# Altium schematic sheet MCU_hall_crossboard_1_1.SchDoc
size A3
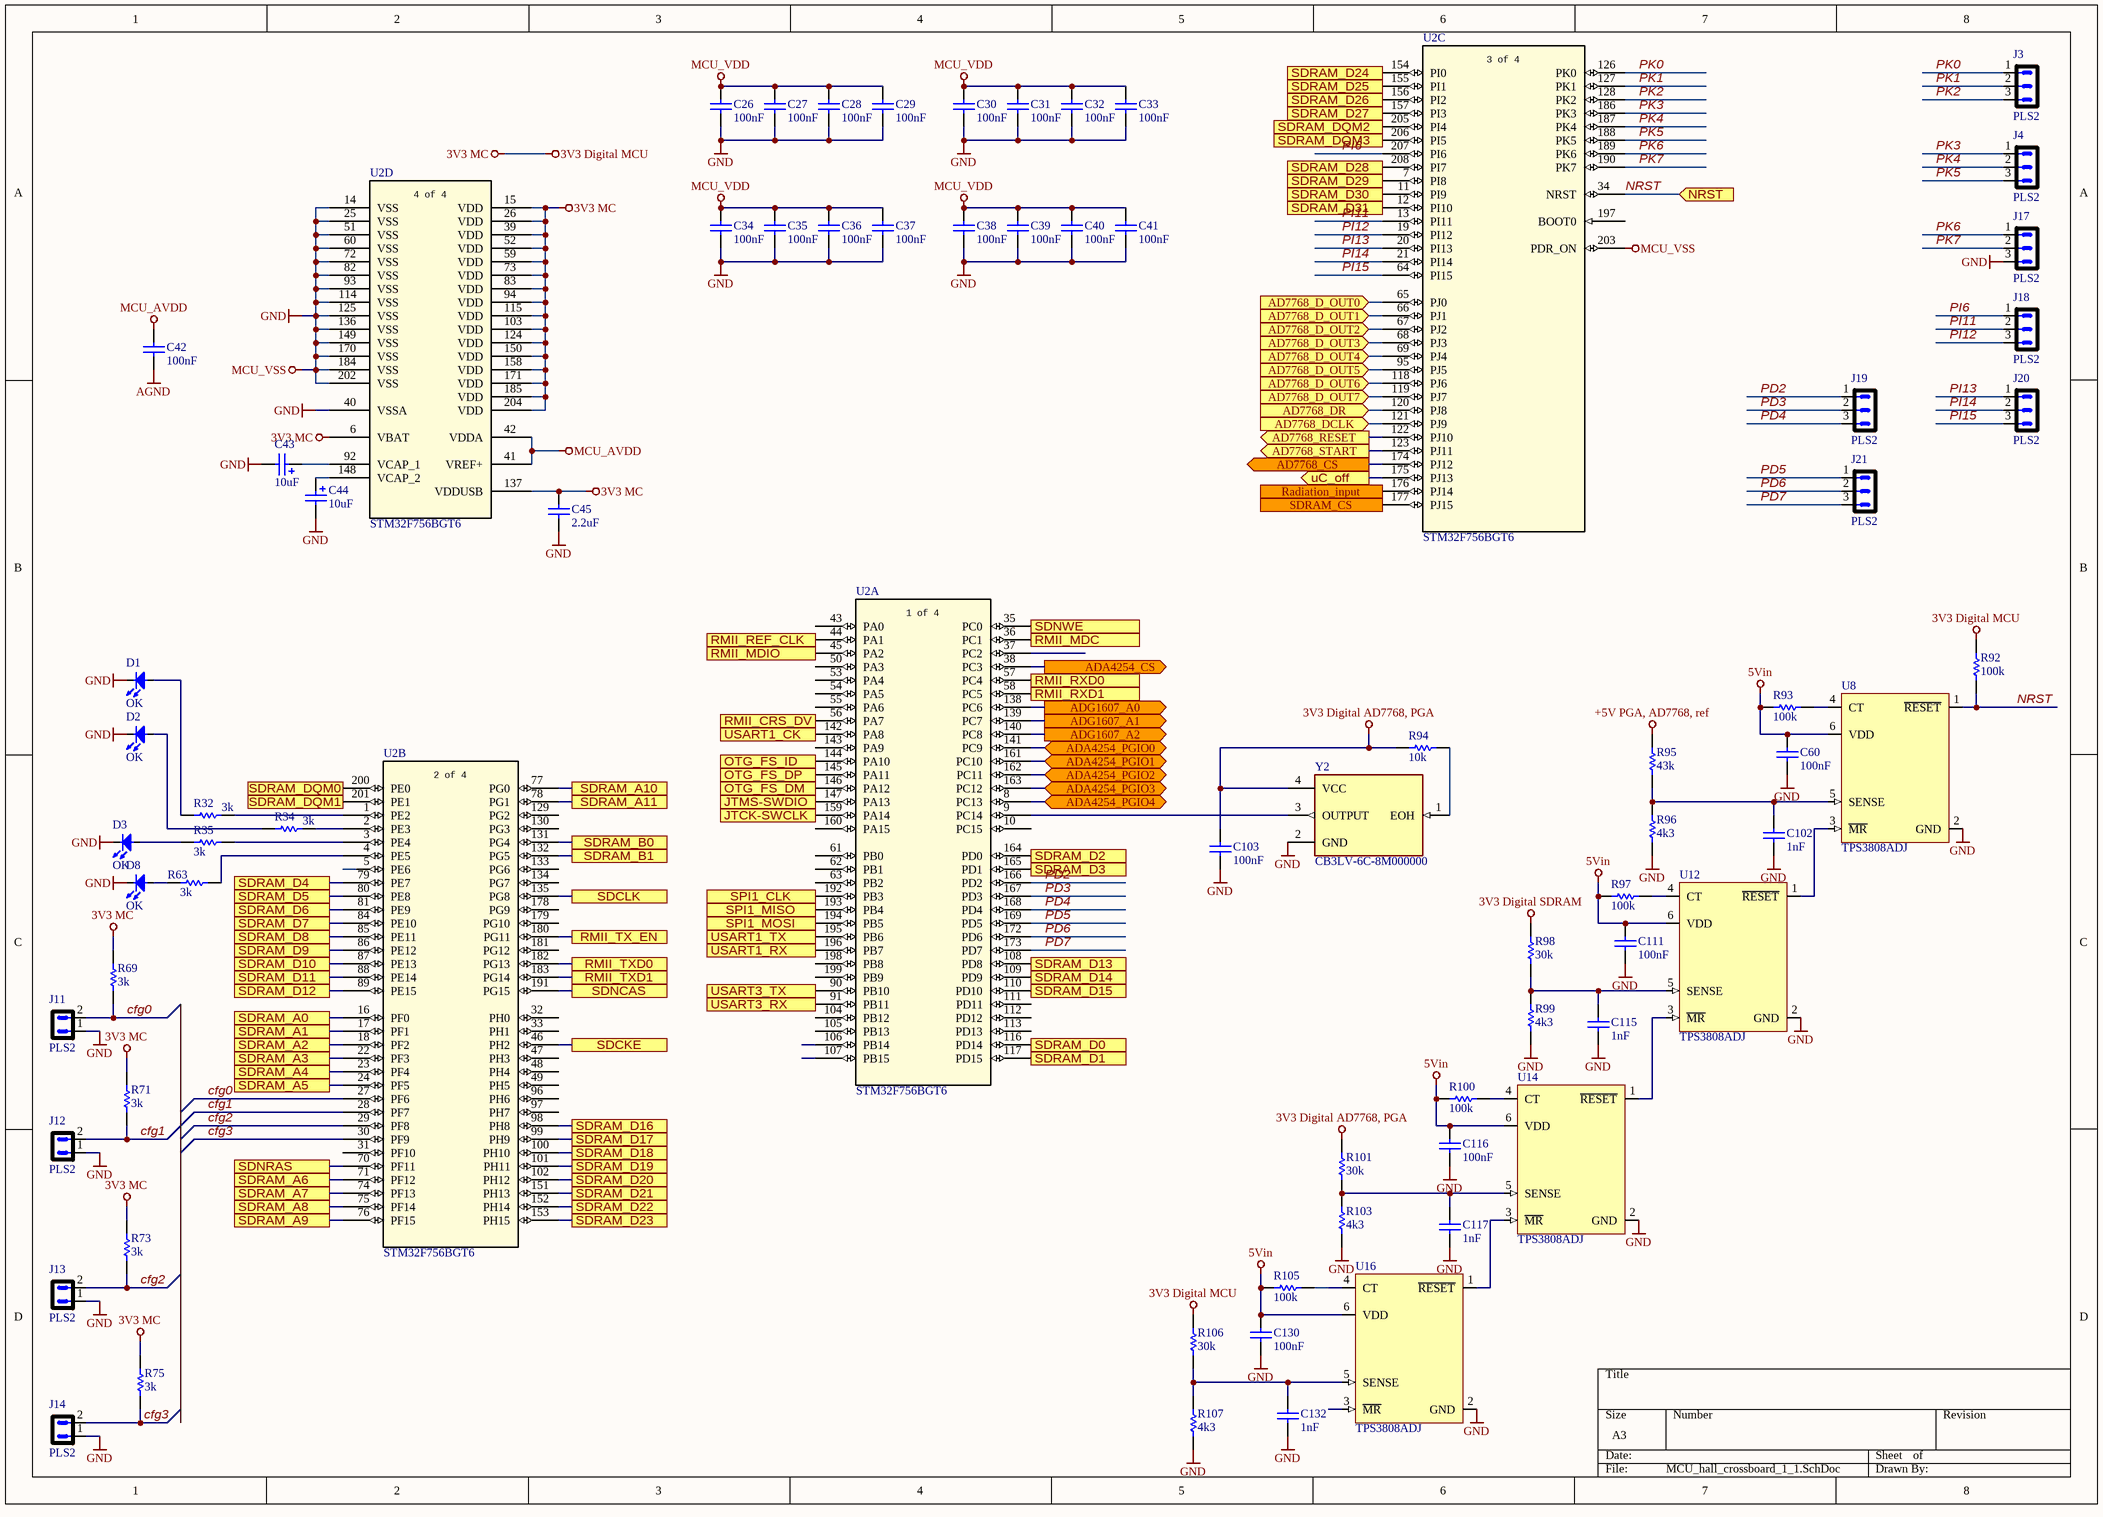
[diagram p0: MCU_hall_crossboard_1_1.SchDoc]

## Parts
C26  100nF  [0603C]
C27  100nF  [0603C]
C28  100nF  [0603C]
C29  100nF  [0603C]
C30  100nF  [0603C]
C31  100nF  [0603C]
C32  100nF  [0603C]
C33  100nF  [0603C]
C34  100nF  [0603C]
C35  100nF  [0603C]
C36  100nF  [0603C]
C37  100nF  [0603C]
C38  100nF  [0603C]
C39  100nF  [0603C]
C40  100nF  [0603C]
C41  100nF  [0603C]
C42  100nF  [0603C]
C43  10uF  [0805C]
C44  10uF  [0805C]
C45  2.2uF  [0805C]
C60  100nF  [0603C]
C102  1nF  [0603C]
C103  100nF  [0603C]
C111  100nF  [0603C]
C115  1nF  [0603C]
C116  100nF  [0603C]
C117  1nF  [0603C]
C130  100nF  [0603C]
C132  1nF  [0603C]
D1  OK  [LED0603]
D2  OK  [LED0603]
D3  OK  [LED0603]
D8  OK  [LED0603]
J3  PLS2  [COMATEL_385.0358.1.03.400]
J4  PLS2  [COMATEL_385.0358.1.03.400]
J11  PLS2  [SAMTEC_TSW-102-23-L-S]
J12  PLS2  [SAMTEC_TSW-102-23-L-S]
J13  PLS2  [SAMTEC_TSW-102-23-L-S]
J14  PLS2  [SAMTEC_TSW-102-23-L-S]
J17  PLS2  [COMATEL_385.0358.1.03.400]
J18  PLS2  [COMATEL_385.0358.1.03.400]
J19  PLS2  [COMATEL_385.0358.1.03.400]
J20  PLS2  [COMATEL_385.0358.1.03.400]
J21  PLS2  [COMATEL_385.0358.1.03.400]
R32  3k  [0603R]
R34  3k  [0603R]
R35  3k  [0603R]
R63  3k  [0603R]
R69  3k  [0603R]
R71  3k  [0603R]
R73  3k  [0603R]
R75  3k  [0603R]
R92  100k  [0805R]
R93  100k  [0805R]
R94  10k  [0805R]
R95  43k  [0805R]
R96  4k3  [0805R]
R97  100k  [0805R]
R98  30k  [0805R]
R99  4k3  [0805R]
R100  100k  [0805R]
R101  30k  [0805R]
R103  4k3  [0805R]
R105  100k  [0805R]
R106  30k  [0805R]
R107  4k3  [0805R]
U2  STM32F756BGT6  [QFP50P3000X3000X160-208N]  (parts A,B,C,D of 4)
U8  TPS3808ADJ  [SOT95P270X145-6N]
U12  TPS3808ADJ  [SOT95P270X145-6N]
U14  TPS3808ADJ  [SOT95P270X145-6N]
U16  TPS3808ADJ  [SOT95P270X145-6N]
Y2  CB3LV-6C-8M000000  [OSC_CB3LV-6C-8M000000]

## Ports
AD7768_CS (out), AD7768_D_OUT0 (in), AD7768_D_OUT1 (in), AD7768_D_OUT2 (in), AD7768_D_OUT3 (in), AD7768_D_OUT4 (in), AD7768_D_OUT5 (in), AD7768_D_OUT6 (in), AD7768_D_OUT7 (in), AD7768_DCLK (in), AD7768_DR (in), AD7768_RESET (out), AD7768_START (out), ADA4254_CS (out), ADA4254_PGIO0 (bidir), ADA4254_PGIO1 (bidir), ADA4254_PGIO2 (bidir), ADA4254_PGIO3 (bidir), ADA4254_PGIO4 (bidir), ADG1607_A0 (out), ADG1607_A1 (out), ADG1607_A2 (out), JTCK-SWCLK, JTMS-SWDIO, NRST (in), OTG_FS_DM, OTG_FS_DP, OTG_FS_ID, Radiation_input (in), RMII_CRS_DV, RMII_MDC, RMII_MDIO, RMII_REF_CLK, RMII_RXD0, RMII_RXD1, RMII_TX_EN, RMII_TXD0, RMII_TXD1, SDCKE, SDCLK, SDNCAS, SDNRAS, SDNWE, SDRAM_A0, SDRAM_A1, SDRAM_A2, SDRAM_A3, SDRAM_A4, SDRAM_A5, SDRAM_A6, SDRAM_A7, SDRAM_A8, SDRAM_A9, SDRAM_A10, SDRAM_A11, SDRAM_B0, SDRAM_B1, SDRAM_CS (out), SDRAM_D0, SDRAM_D1, SDRAM_D2, SDRAM_D3, SDRAM_D4, SDRAM_D5, SDRAM_D6, SDRAM_D7, SDRAM_D8, SDRAM_D9, SDRAM_D10, SDRAM_D11, SDRAM_D12, SDRAM_D13, SDRAM_D14, SDRAM_D15, SDRAM_D16, SDRAM_D17, SDRAM_D18, SDRAM_D19, SDRAM_D20, SDRAM_D21, SDRAM_D22, SDRAM_D23, SDRAM_D24, SDRAM_D25, SDRAM_D26, SDRAM_D27, SDRAM_D28, SDRAM_D29, SDRAM_D30, SDRAM_D31, SDRAM_DQM0, SDRAM_DQM1, SDRAM_DQM2, SDRAM_DQM3, SPI1_CLK, SPI1_MISO, SPI1_MOSI, uC_off (out), USART1_CK, USART1_RX, USART1_TX, USART3_RX, USART3_TX

## Nets
3V3 Digital AD7768, PGA: C103.1 R94.1 R101.2 Y2.4(VCC)
3V3 Digital MCU: C45.2 R69.2 R71.2 R73.2 R75.2 R92.2 R106.2 U2.6(VBAT) U2.15(VDD) U2.26(VDD) U2.39(VDD) U2.52(VDD) U2.59(VDD) U2.73(VDD) U2.83(VDD) U2.94(VDD) U2.103(VDD) U2.115(VDD) U2.124(VDD) U2.137(VDDUSB) U2.150(VDD) U2.158(VDD) U2.171(VDD) U2.185(VDD) U2.204(VDD)  [also labelled 3V3 MC]
3V3 Digital SDRAM: R98.2
5Vin: C60.2 C111.2 C116.2 C130.2 R93.1 R97.1 R100.1 R105.1 U8.6(VDD) U12.6(VDD) U14.6(VDD) U16.6(VDD)
+5V PGA, AD7768, ref: R95.2
AGND: C42.1
GND: C26.1 C27.1 C28.1 C29.1 C30.1 C31.1 C32.1 C33.1 C34.1 C35.1 C36.1 C37.1 C38.1 C39.1 C40.1 C41.1 C43.2 C44.2 C45.1 C60.1 C102.1 C103.2 C111.1 C115.1 C116.1 C117.1 C130.1 C132.1 D1.1(C) D2.1(C) D3.1(C) D8.1(C) J11.1 J12.1 J13.1 J14.1 J17.3 R96.1 R99.1 R103.1 R107.1 U2.14(VSS) U2.25(VSS) U2.40(VSSA) U2.51(VSS) U2.60(VSS) U2.72(VSS) U2.82(VSS) U2.93(VSS) U2.114(VSS) U2.125(VSS) U2.136(VSS) U2.149(VSS) U2.170(VSS) U2.184(VSS) U2.202(VSS) U2.203(PDR_ON) U8.2(GND) U12.2(GND) U14.2(GND) U16.2(GND) Y2.2(GND)  [also labelled MCU_VSS]
MCU_AVDD: C42.2 U2.41(VREF+) U2.42(VDDA)
MCU_VDD: C26.2 C27.2 C28.2 C29.2 C30.2 C31.2 C32.2 C33.2 C34.2 C35.2 C36.2 C37.2 C38.2 C39.2 C40.2 C41.2
AD7768_CS: U2.174(PJ12) ; port AD7768_CS
AD7768_D_OUT0: U2.65(PJ0) ; port AD7768_D_OUT0
AD7768_D_OUT1: U2.66(PJ1) ; port AD7768_D_OUT1
AD7768_D_OUT2: U2.67(PJ2) ; port AD7768_D_OUT2
AD7768_D_OUT3: U2.68(PJ3) ; port AD7768_D_OUT3
AD7768_D_OUT4: U2.69(PJ4) ; port AD7768_D_OUT4
AD7768_D_OUT5: U2.95(PJ5) ; port AD7768_D_OUT5
AD7768_D_OUT6: U2.118(PJ6) ; port AD7768_D_OUT6
AD7768_D_OUT7: U2.119(PJ7) ; port AD7768_D_OUT7
AD7768_DCLK: U2.121(PJ9) ; port AD7768_DCLK
AD7768_DR: U2.120(PJ8) ; port AD7768_DR
AD7768_RESET: U2.122(PJ10) ; port AD7768_RESET
AD7768_START: U2.123(PJ11) ; port AD7768_START
ADA4254_CS: U2.38(PC3) ; port ADA4254_CS
ADA4254_PGIO0: U2.141(PC9) ; port ADA4254_PGIO0
ADA4254_PGIO1: U2.161(PC10) ; port ADA4254_PGIO1
ADA4254_PGIO2: U2.162(PC11) ; port ADA4254_PGIO2
ADA4254_PGIO3: U2.163(PC12) ; port ADA4254_PGIO3
ADA4254_PGIO4: U2.8(PC13) ; port ADA4254_PGIO4
ADG1607_A0: U2.138(PC6) ; port ADG1607_A0
ADG1607_A1: U2.139(PC7) ; port ADG1607_A1
ADG1607_A2: U2.140(PC8) ; port ADG1607_A2
cfg0: J11.2 R69.1 U2.27(PF6)
cfg1: J12.2 R71.1 U2.28(PF7)
cfg2: J13.2 R73.1 U2.29(PF8)
cfg3: J14.2 R75.1 U2.30(PF9)
JTCK-SWCLK: U2.159(PA14) ; port JTCK-SWCLK
JTMS-SWDIO: U2.147(PA13) ; port JTMS-SWDIO
NRST: R92.1 U2.34(NRST) U8.1(~{RESET}) ; port NRST
OTG_FS_DM: U2.146(PA12) ; port OTG_FS_DM
OTG_FS_DP: U2.145(PA11) ; port OTG_FS_DP
OTG_FS_ID: U2.144(PA10) ; port OTG_FS_ID
PD2: J19.1 U2.166(PD2)
PD3: J19.2 U2.167(PD3)
PD4: J19.3 U2.168(PD4)
PD5: J21.1 U2.169(PD5)
PD6: J21.2 U2.172(PD6)
PD7: J21.3 U2.173(PD7)
PI6: J18.1 U2.207(PI6)
PI11: J18.2 U2.13(PI11)
PI12: J18.3 U2.19(PI12)
PI13: J20.1 U2.20(PI13)
PI14: J20.2 U2.21(PI14)
PI15: J20.3 U2.64(PI15)
PK0: J3.1 U2.126(PK0)
PK1: J3.2 U2.127(PK1)
PK2: J3.3 U2.128(PK2)
PK3: J4.1 U2.186(PK3)
PK4: J4.2 U2.187(PK4)
PK5: J4.3 U2.188(PK5)
PK6: J17.1 U2.189(PK6)
PK7: J17.2 U2.190(PK7)
Radiation_input: U2.176(PJ14) ; port Radiation_input
RMII_CRS_DV: U2.56(PA7) ; port RMII_CRS_DV
RMII_MDC: U2.36(PC1) ; port RMII_MDC
RMII_MDIO: U2.45(PA2) ; port RMII_MDIO
RMII_REF_CLK: U2.44(PA1) ; port RMII_REF_CLK
RMII_RXD0: U2.57(PC4) ; port RMII_RXD0
RMII_RXD1: U2.58(PC5) ; port RMII_RXD1
RMII_TX_EN: U2.180(PG11) ; port RMII_TX_EN
RMII_TXD0: U2.182(PG13) ; port RMII_TXD0
RMII_TXD1: U2.183(PG14) ; port RMII_TXD1
SDCKE: U2.46(PH2) ; port SDCKE
SDCLK: U2.135(PG8) ; port SDCLK
SDNCAS: U2.191(PG15) ; port SDNCAS
SDNRAS: U2.70(PF11) ; port SDNRAS
SDNWE: U2.35(PC0) ; port SDNWE
SDRAM_A0: U2.16(PF0) ; port SDRAM_A0
SDRAM_A1: U2.17(PF1) ; port SDRAM_A1
SDRAM_A2: U2.18(PF2) ; port SDRAM_A2
SDRAM_A3: U2.22(PF3) ; port SDRAM_A3
SDRAM_A4: U2.23(PF4) ; port SDRAM_A4
SDRAM_A5: U2.24(PF5) ; port SDRAM_A5
SDRAM_A6: U2.71(PF12) ; port SDRAM_A6
SDRAM_A7: U2.74(PF13) ; port SDRAM_A7
SDRAM_A8: U2.75(PF14) ; port SDRAM_A8
SDRAM_A9: U2.76(PF15) ; port SDRAM_A9
SDRAM_A10: U2.77(PG0) ; port SDRAM_A10
SDRAM_A11: U2.78(PG1) ; port SDRAM_A11
SDRAM_B0: U2.131(PG4) ; port SDRAM_B0
SDRAM_B1: U2.132(PG5) ; port SDRAM_B1
SDRAM_CS: U2.177(PJ15) ; port SDRAM_CS
SDRAM_D0: U2.116(PD14) ; port SDRAM_D0
SDRAM_D1: U2.117(PD15) ; port SDRAM_D1
SDRAM_D2: U2.164(PD0) ; port SDRAM_D2
SDRAM_D3: U2.165(PD1) ; port SDRAM_D3
SDRAM_D4: U2.79(PE7) ; port SDRAM_D4
SDRAM_D5: U2.80(PE8) ; port SDRAM_D5
SDRAM_D6: U2.81(PE9) ; port SDRAM_D6
SDRAM_D7: U2.84(PE10) ; port SDRAM_D7
SDRAM_D8: U2.85(PE11) ; port SDRAM_D8
SDRAM_D9: U2.86(PE12) ; port SDRAM_D9
SDRAM_D10: U2.87(PE13) ; port SDRAM_D10
SDRAM_D11: U2.88(PE14) ; port SDRAM_D11
SDRAM_D12: U2.89(PE15) ; port SDRAM_D12
SDRAM_D13: U2.108(PD8) ; port SDRAM_D13
SDRAM_D14: U2.109(PD9) ; port SDRAM_D14
SDRAM_D15: U2.110(PD10) ; port SDRAM_D15
SDRAM_D16: U2.98(PH8) ; port SDRAM_D16
SDRAM_D17: U2.99(PH9) ; port SDRAM_D17
SDRAM_D18: U2.100(PH10) ; port SDRAM_D18
SDRAM_D19: U2.101(PH11) ; port SDRAM_D19
SDRAM_D20: U2.102(PH12) ; port SDRAM_D20
SDRAM_D21: U2.151(PH13) ; port SDRAM_D21
SDRAM_D22: U2.152(PH14) ; port SDRAM_D22
SDRAM_D23: U2.153(PH15) ; port SDRAM_D23
SDRAM_D24: U2.154(PI0) ; port SDRAM_D24
SDRAM_D25: U2.155(PI1) ; port SDRAM_D25
SDRAM_D26: U2.156(PI2) ; port SDRAM_D26
SDRAM_D27: U2.157(PI3) ; port SDRAM_D27
SDRAM_D28: U2.208(PI7) ; port SDRAM_D28
SDRAM_D29: U2.7(PI8) ; port SDRAM_D29
SDRAM_D30: U2.11(PI9) ; port SDRAM_D30
SDRAM_D31: U2.12(PI10) ; port SDRAM_D31
SDRAM_DQM0: U2.200(PE0) ; port SDRAM_DQM0
SDRAM_DQM1: U2.201(PE1) ; port SDRAM_DQM1
SDRAM_DQM2: U2.205(PI4) ; port SDRAM_DQM2
SDRAM_DQM3: U2.206(PI5) ; port SDRAM_DQM3
SPI1_CLK: U2.192(PB3) ; port SPI1_CLK
SPI1_MISO: U2.193(PB4) ; port SPI1_MISO
SPI1_MOSI: U2.194(PB5) ; port SPI1_MOSI
uC_off: U2.175(PJ13) ; port uC_off
USART1_CK: U2.142(PA8) ; port USART1_CK
USART1_RX: U2.196(PB7) ; port USART1_RX
USART1_TX: U2.195(PB6) ; port USART1_TX
USART3_RX: U2.91(PB11) ; port USART3_RX
USART3_TX: U2.90(PB10) ; port USART3_TX
NetC43_1: C43.1 U2.92(VCAP_1)
NetC44_1: C44.1 U2.148(VCAP_2)
NetC102_2: C102.2 R95.1 R96.2 U8.5(SENSE)
NetC115_2: C115.2 R98.1 R99.2 U12.5(SENSE)
NetC117_2: C117.2 R101.1 R103.2 U14.5(SENSE)
NetC132_2: C132.2 R106.1 R107.2 U16.5(SENSE)
NetD1_2: D1.2(A) R32.1
NetD2_2: D2.2(A) R34.1
NetD3_2: D3.2(A) R35.1
NetD8_2: D8.2(A) R63.1
NetR32_2: R32.2 U2.1(PE2)
NetR34_2: R34.2 U2.2(PE3)
NetR35_2: R35.2 U2.3(PE4)
NetR63_2: R63.2 U2.4(PE5)
NetR93_2: R93.2 U8.4(CT)
NetR94_2: R94.2 Y2.1(EOH)
NetR97_2: R97.2 U12.4(CT)
NetR100_2: R100.2 U14.4(CT)
NetR105_2: R105.2 U16.4(CT)
NetU2_9: U2.9(PC14) Y2.3(OUTPUT)
NetU8_3: U8.3(~{MR}) U12.1(~{RESET})
NetU12_3: U12.3(~{MR}) U14.1(~{RESET})
NetU14_3: U14.3(~{MR}) U16.1(~{RESET})

Not connected (* = marked no-connect by the designer): U2 5(PE6) 10(PC15) 31(PF10) 32(PH0) 33(PH1) 37(PC2) 43(PA0) 47(PH3) 48(PH4) 49(PH5) 50(PA3) 53(PA4) 54(PA5) 55(PA6) 61(PB0) 62(PB1) 63(PB2) 96(PH6) 97(PH7) 104(PB12) 105(PB13) 106(PB14) 107(PB15) 111(PD11) 112(PD12) 113(PD13) 129(PG2) 130(PG3) 133(PG6) 134(PG7) 143(PA9) 160(PA15) 178(PG9) 179(PG10) 181(PG12) 197(BOOT0) 198(PB8) 199(PB9); U16 3(~{MR})

## Notes on the sheet
- (in symbol STM32F756BGT6, part A) 1 of 4
- (in symbol STM32F756BGT6, part B) 2 of 4
- (in symbol STM32F756BGT6, part C) 3 of 4
- (in symbol STM32F756BGT6, part D) 4 of 4

## Library data of the parts
C26-C42 C45 C60 C103 C111 C116 C130 = Capacitor_ST: Capacitor 0402 / 0603 / 0805; Revision: July-2002: Re-released for DXP Platform.
  C26-C42 C60 C103 C111 C116 C130: Value: 100nF
  C45: Value: 2.2uF
C43 C44 = Cap_10uF_POL_10%_TANA: Polarized Capacitor,10uF,10V,10%,typeA,VISHAY; Manuf_Part_1: 293D106X9010A2TE3; Revision: July-2002: Re-released for DXP Platform.; Value: 10uF; Manuf_1: VISHAY; Order: *; ECCN_US/EU: n/a
C102 C115 C117 C132 = Capacitor_ST: Capacitor 0402 / 0603 / 0805; Value: 100nF; Revision: July-2002: Re-released for DXP Platform.
D1-D3 D8 = LED0603: Чип светодиод 0603; Vendor: KB; SMD Solders: 2; Solder Option: RM; Pkg: SMD0603; Price: 10; Value: OK; Device: LED0603
J3 J4 J17-J21 = PLS3: Vendor: Confly; SMD Solders: 0; Solder Option: RM; THD Solders: 2; Price: 1; Device: PLS2
J11-J14 = PLS2: Vendor: Confly; SMD Solders: 0; Solder Option: RM; THD Solders: 2; Price: 1; Device: PLS2
R32 R34 R35 R63 R69 R71 R73 R75 R92 R93 R96-R101 R103 R105-R107 = Resistor_ST: Resistor 0402 / 0603 / 0805
  R32 R34 R35 R63 R69 R71 R73 R75: Value: 3k
  R92 R93 R97 R100 R105: Value: 100k
  R96 R99 R103 R107: Value: 4k3
  R98 R101 R106: Value: 30k
R94 = Resistor_ST: Resistor 0402 / 0603 / 0805 c2; Value: 10k
R95 = Resistor_ST: Resistor 0402 / 0603 / 0805; Value: 10K
U2 = STM32F756BGT6: No Description Available; Mfr_Name: STMicroelectronics; RefDes: RefDes; Type: Type
U8 U12 U14 U16 = TPS3808: Supervisory Circuit. Low-Quiescent-Current, Programmable-Delay; Vendor: Texas Instruments; Value: ADJ; Pkg: SOT23-6; SMD Solders: 6; Solder Option: RM; THD Solders: 0; Name to order: TPS3808G01DBV; Current: 6uA; thVoltage: 400mV; Price: 200; Device: TPS3808
Y2 = CB3LV-6C-8M000000: 8 MHz XO (Standard) HCMOS, TTL Oscillator 3.3V Enable/Disable 4-SMD, No Lead; MF: CTS-Frequency Controls; SnapEDA_Link: https://www.snapeda.com/parts/CB3LV-6C-8M000000/CTS-Frequency+Controls/view-part/?ref=snap; Package: NON STANDARD-4 CTS; Value: *; MP: CB3LV-6C-8M000000; Check_prices: https://www.snapeda.com/parts/CB3LV-6C-8M000000/CTS-Frequency+Controls/view-part/?ref=eda